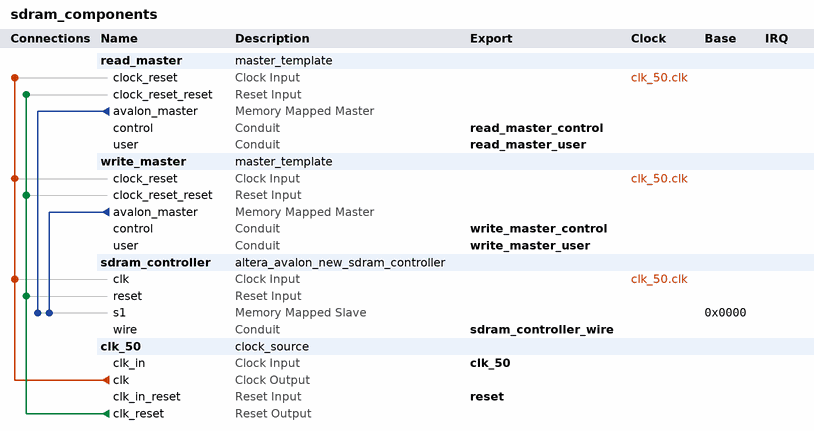
[diagram p0: system contents]
# Platform Designer (Qsys) system sdram_components, Cyclone IV E EP4CE115F29C7
# Parameters at their usual value, and those the tool derives, are not listed.
package require -exact qsys 16.1
create_system sdram_components
set_project_property DEVICE_FAMILY {Cyclone IV E}
set_project_property DEVICE EP4CE115F29C7

add_instance read_master master_template 1.0
set_instance_parameter_value read_master ADDRESS_WIDTH 32
set_instance_parameter_value read_master BURST_CAPABLE 1
set_instance_parameter_value read_master DATA_WIDTH 32
set_instance_parameter_value read_master FIFO_DEPTH 128
set_instance_parameter_value read_master MASTER_DIRECTION 0
set_instance_parameter_value read_master MAXIMUM_BURST_COUNT 2
set_instance_parameter_value read_master MEMORY_BASED_FIFO 1

add_instance write_master master_template 1.0
set_instance_parameter_value write_master ADDRESS_WIDTH 32
set_instance_parameter_value write_master BURST_CAPABLE 1
set_instance_parameter_value write_master DATA_WIDTH 32
set_instance_parameter_value write_master FIFO_DEPTH 128
set_instance_parameter_value write_master MASTER_DIRECTION 1
set_instance_parameter_value write_master MAXIMUM_BURST_COUNT 2
set_instance_parameter_value write_master MEMORY_BASED_FIFO 1

add_instance sdram_controller altera_avalon_new_sdram_controller 16.1
set_instance_parameter_value sdram_controller TAC 5.5
set_instance_parameter_value sdram_controller TRCD 20.0
set_instance_parameter_value sdram_controller TRP 20.0
set_instance_parameter_value sdram_controller casLatency 3
set_instance_parameter_value sdram_controller columnWidth 10
set_instance_parameter_value sdram_controller dataWidth 32
set_instance_parameter_value sdram_controller generateSimulationModel false
set_instance_parameter_value sdram_controller model single_Micron_MT48LC4M32B2_7_chip
set_instance_parameter_value sdram_controller numberOfBanks 4
set_instance_parameter_value sdram_controller numberOfChipSelects 1
set_instance_parameter_value sdram_controller powerUpDelay 200.0
set_instance_parameter_value sdram_controller refreshPeriod 7.8125
set_instance_parameter_value sdram_controller rowWidth 13

add_instance clk_50 clock_source 16.1
set_instance_parameter_value clk_50 clockFrequency 50000000

# connections
add_connection clk_50.clk read_master.clock_reset clock
add_connection clk_50.clk sdram_controller.clk clock
add_connection clk_50.clk write_master.clock_reset clock
add_connection clk_50.clk_reset read_master.clock_reset_reset reset
add_connection clk_50.clk_reset sdram_controller.reset reset
add_connection clk_50.clk_reset write_master.clock_reset_reset reset
add_connection read_master.avalon_master sdram_controller.s1 avalon
set_connection_parameter_value read_master.avalon_master/sdram_controller.s1 baseAddress 0x0000
add_connection write_master.avalon_master sdram_controller.s1 avalon
set_connection_parameter_value write_master.avalon_master/sdram_controller.s1 baseAddress 0x0000

# exported interfaces
add_interface clk_50 clock sink
set_interface_property clk_50 EXPORT_OF clk_50.clk_in
add_interface read_master_control conduit end
set_interface_property read_master_control EXPORT_OF read_master.control
add_interface read_master_user conduit end
set_interface_property read_master_user EXPORT_OF read_master.user
add_interface reset reset sink
set_interface_property reset EXPORT_OF clk_50.clk_in_reset
add_interface sdram_controller_wire conduit end
set_interface_property sdram_controller_wire EXPORT_OF sdram_controller.wire
add_interface write_master_control conduit end
set_interface_property write_master_control EXPORT_OF write_master.control
add_interface write_master_user conduit end
set_interface_property write_master_user EXPORT_OF write_master.user

set_interconnect_requirement {$system} qsys_mm.clockCrossingAdapter HANDSHAKE
set_interconnect_requirement {$system} qsys_mm.enableEccProtection FALSE
set_interconnect_requirement {$system} qsys_mm.insertDefaultSlave FALSE
set_interconnect_requirement {$system} qsys_mm.maxAdditionalLatency 1

save_system sdram_components.qsys
